# EAGLE schematic leadtech-arduino-CSPG_concept (EAGLE 9.1.3)
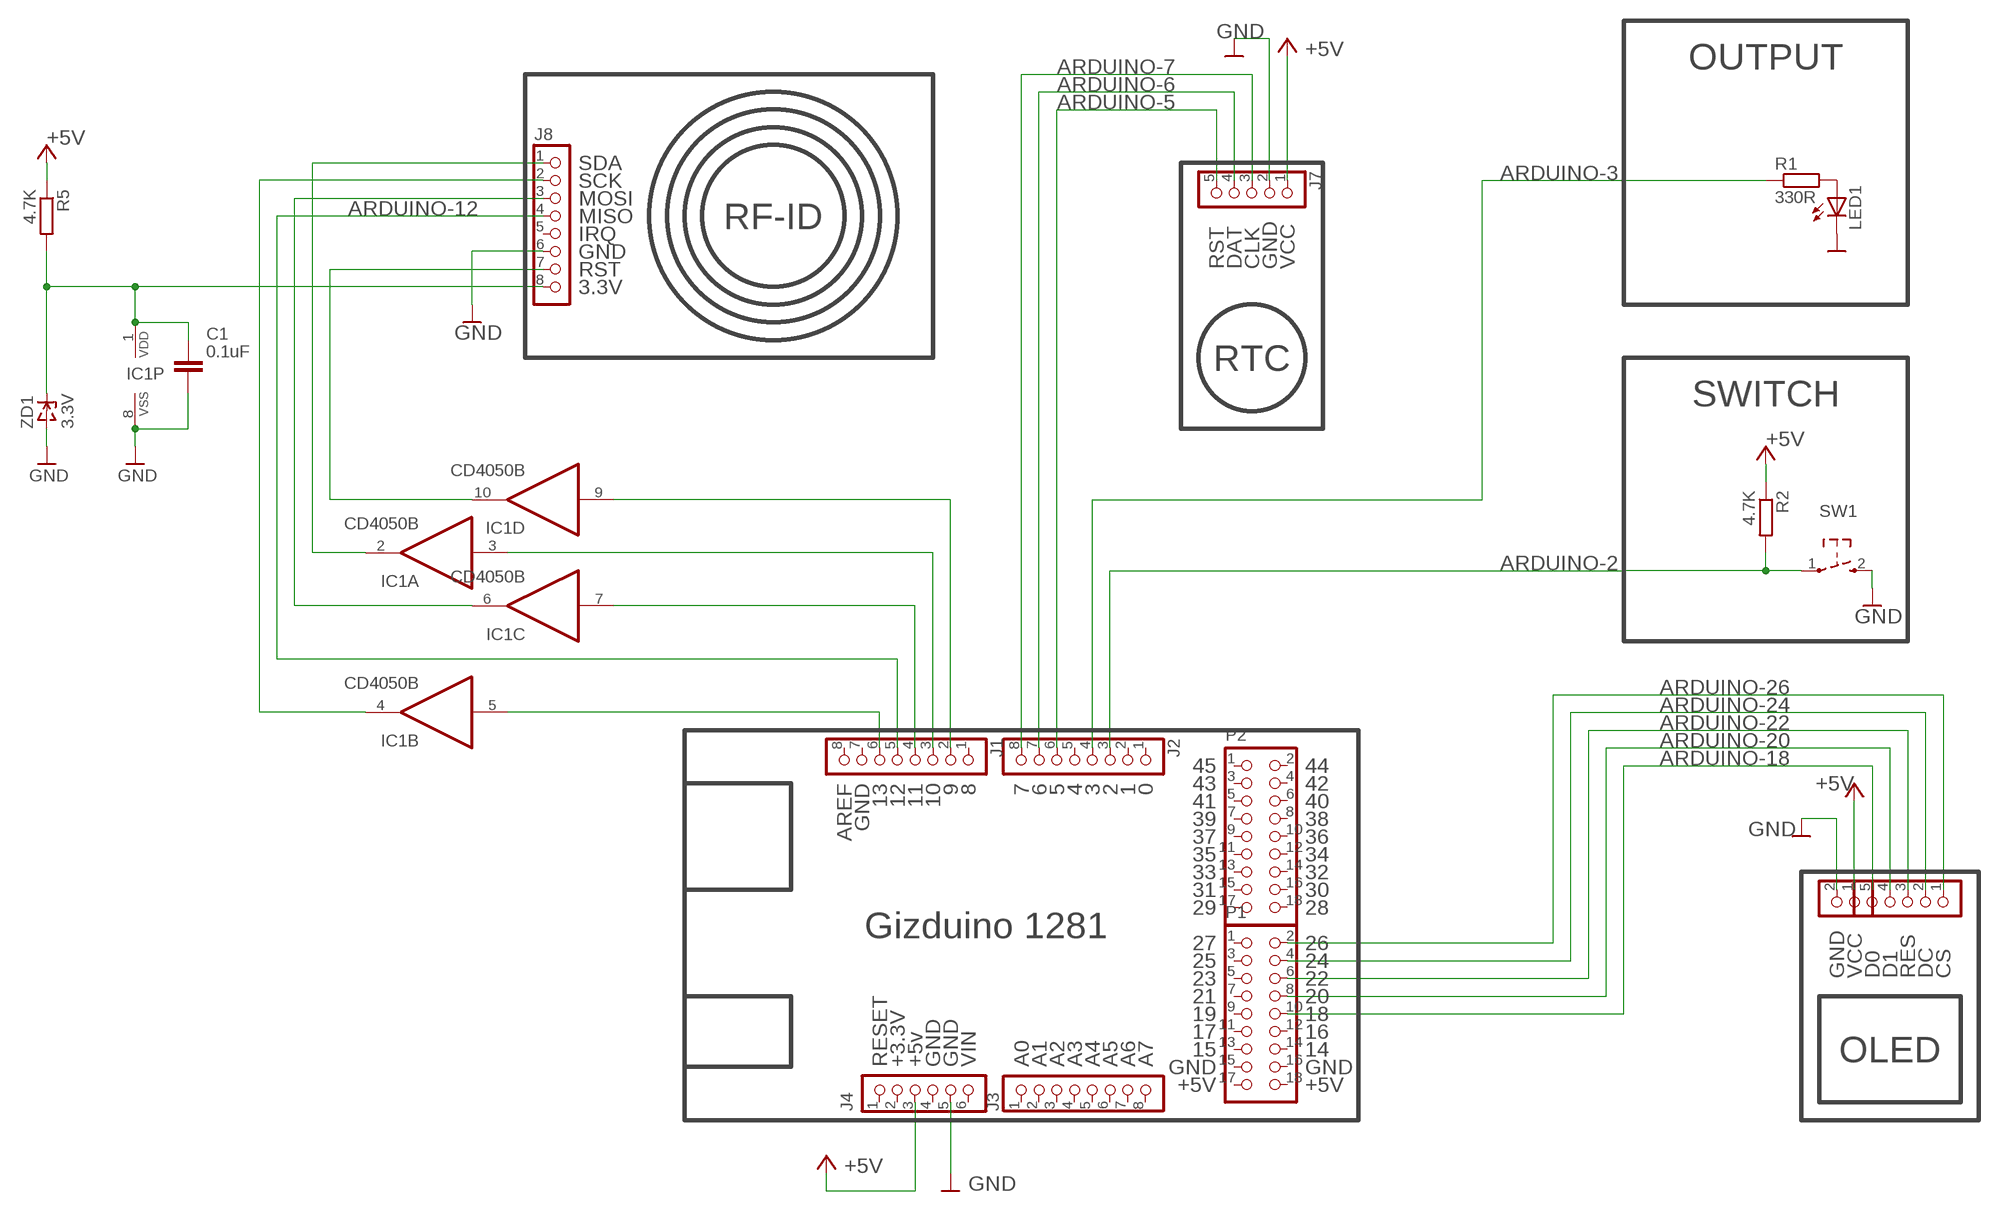
[diagram p0: schematic, sheet 1]

## Parts
C1  0.1uF  CAPACITOR_NPOL-PTH_0.1"  [C0.1PTH]
IC1  CD4050B  4050N  [DIL16]
J1  CON_HEADER_1X08-PTH  [M1X8]
J2  CON_HEADER_1X08-PTH  [M1X8]
J3  CON_HEADER_1X08-PTH  [M1X8]
J4  CON_HEADER_1X06-PTH  [M1X6]
J5  CON_HEADER_1X05-PTH  [M1X5]
J6  CON_HEADER_1X02-PTH  [M1X2]
J7  CON_HEADER_1X05-PTH  [M1X5]
J8  CON_HEADER_1X08-PTH  [M1X8]
LED1  LED-5MM  [LED-5MM]
P1  CON_HEADER_2X09  [M2X9]
P2  CON_HEADER_2X09  [M2X9]
R1  330R  RESISTOR-0603  [R603]
R2  4.7K  RESISTOR-0603  [R603]
R5  4.7K  RESISTOR-0603  [R603]
SW1  SW_TACT_2P-3X6  [SW_TACT_3X6]
ZD1  3.3V  ZENERSOD-123  [SOD-123]

## Nets
+5V: J4.3 J6.1 J7.1 R2.1 R5.1 ; supply symbol labelled SUPPLY_+5V
ARDUINO-2: J2.3 R2.2 SW1.1
ARDUINO-3: J2.4 R1.1
ARDUINO-5: J2.6 J7.5
ARDUINO-6: J2.7 J7.4
ARDUINO-7: J2.8 J7.3
ARDUINO-9: IC1.9(D:I) J1.2
ARDUINO-10: IC1.3(A:I) J1.3
ARDUINO-12: J1.5 J8.4
ARDUINO-18: J5.5 P1.10
ARDUINO-20: J5.4 P1.8
ARDUINO-22: J5.3 P1.6
ARDUINO-24: J5.2 P1.4
ARDUINO-26: J5.1 P1.2
GND: C1.2 IC1.8(P:VSS) J4.5 J6.2 J7.2 J8.6 LED1.K(C) SW1.2 ZD1.A ; supply symbol labelled SUPPLY_GND
N$1: C1.1 IC1.1(P:VDD) J8.8 R5.2 ZD1.C
N$2: IC1.2(A:O) J8.1
N$3: IC1.5(B:I) J1.6
N$4: IC1.4(B:O) J8.2
N$5: IC1.7(C:I) J1.4
N$6: IC1.6(C:O) J8.3
N$7: IC1.10(D:O) J8.7
N$9: LED1.A R1.2
Unconnected: IC1.11(E:I) IC1.12(E:O) IC1.14(F:I) IC1.15(F:O) J1.1 J1.7 J1.8 J2.1 J2.2 J2.5 J3.1 J3.2 J3.3 J3.4 J3.5 J3.6 J3.7 J3.8 J4.1 J4.2 J4.4 J4.6 J8.5 P1.1 P1.3 P1.5 P1.7 P1.9 P1.11 P1.12 P1.13 P1.14 P1.15 P1.16 P1.17 P1.18 P2.1 P2.2 P2.3 P2.4 P2.5 P2.6 P2.7 P2.8 P2.9 P2.10 P2.11 P2.12 P2.13 P2.14 P2.15 P2.16 P2.17 P2.18

## Notes on the sheet
- OUTPUT
- SDA
- SCK
- MOSI
- MISO | RF-ID
- IRQ
- GND
- RST | RST | DAT | CLK | GND | VCC
- 3.3V
- RTC
- SWITCH
- 45 | 44
- AREF | GND | 13 | 12 | 11 | 10 | 9 | 8 | 7 | 6 | 5 | 4 | 3 | 2 | 1 | 0 | 43 | 42
- 41 | 40
- 39 | 38
- 37 | 36
- 35 | 34
- 33 | 32
- 31 | 30
- 29 | 28
- Gizduino 1281
- 27 | 26
- 25 | 24
- 23 | 22 | GND | VCC | D0 | D1 | RES | DC | CS
- 21 | 20
- 19 | 18
- 17 | 16
- 15 | 14 | OLED
- RESET | +3.3V | +5v | GND | GND | VIN | A0 | A1 | A2 | A3 | A4 | A5 | A6 | A7 | GND | GND
- +5V | +5V

## Library data of the parts
C1 = dp_devices.v6:CAPACITOR_NPOL: Non-Polarized capacitor in various packages
IC1 = 40xx:4050: Hex non-inverting BUFFER
J1-J3 J8 = dp_devices.v6:CON_HEADER_1X08
J4 = dp_devices.v6:CON_HEADER_1X06
J5 J7 = dp_devices.v6:CON_HEADER_1X05
J6 = dp_devices.v6:CON_HEADER_1X02
LED1 = dp_devices.v6:LED: Light Emitting Diode
P1 P2 = dp_devices.v6:CON_HEADER_2X09
R1 R2 R5 = dp_devices.v6:RESISTOR
SW1 = dp_devices.v6:SW_TACT_2P
ZD1 = dp_devices.v6:ZENER: Zener Diode SOD-323